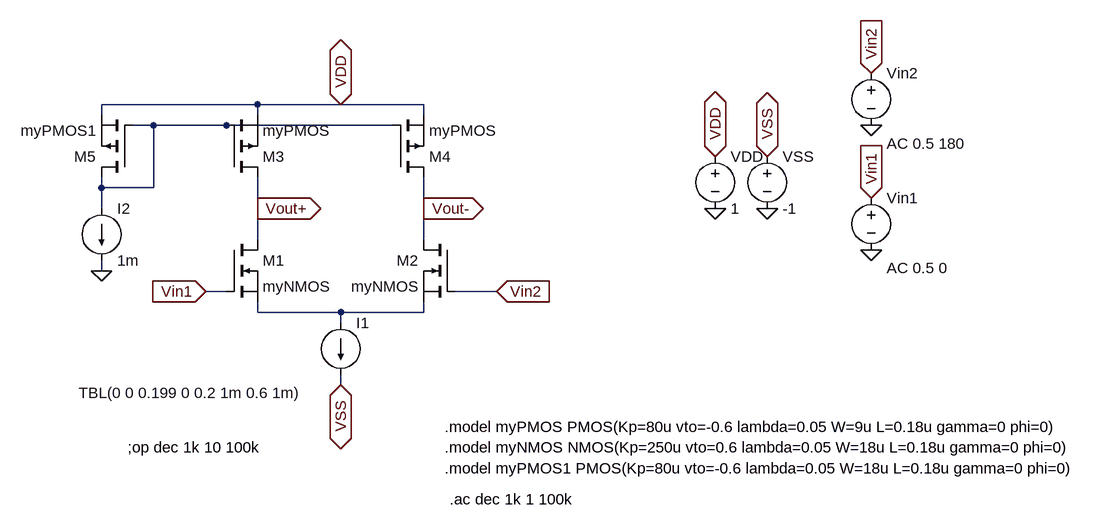
[diagram p0: schematic Project_part3.asc]
Project_part3.asc, the LTspice schematic file:
Version 4
SHEET 1 1544 680
WIRE 176 48 -64 48
WIRE 304 48 176 48
WIRE 432 48 304 48
WIRE -64 64 -64 48
WIRE 176 64 176 48
WIRE 432 64 432 48
WIRE 16 80 -16 80
WIRE 128 80 16 80
WIRE 384 80 128 80
WIRE -64 176 -64 160
WIRE 16 176 16 80
WIRE 16 176 -64 176
WIRE -64 208 -64 176
WIRE 176 208 176 160
WIRE 432 208 432 160
WIRE 176 256 176 208
WIRE 432 256 432 208
WIRE -64 304 -64 288
WIRE 128 336 96 336
WIRE 544 336 480 336
WIRE 176 368 176 352
WIRE 304 368 176 368
WIRE 432 368 432 352
WIRE 432 368 304 368
WIRE 304 384 304 368
WIRE 304 480 304 464
FLAG -64 304 0
FLAG 176 208 Vout+
IOPIN 176 208 Out
FLAG 432 208 Vout-
IOPIN 432 208 Out
FLAG 96 336 Vin1
IOPIN 96 336 In
FLAG 544 336 Vin2
IOPIN 544 336 In
FLAG 1120 272 0
FLAG 960 208 0
FLAG 880 208 0
FLAG 1120 80 0
FLAG 880 128 VDD
IOPIN 880 128 BiDir
FLAG 304 48 VDD
IOPIN 304 48 BiDir
FLAG 960 128 VSS
IOPIN 960 128 BiDir
FLAG 304 480 VSS
IOPIN 304 480 BiDir
FLAG 1120 192 Vin1
IOPIN 1120 192 In
FLAG 1120 0 Vin2
IOPIN 1120 0 In
SYMBOL pmos 384 160 M180
SYMATTR InstName M4
SYMATTR Value myPMOS
SYMBOL pmos 128 160 M180
SYMATTR InstName M3
SYMATTR Value myPMOS
SYMBOL nmos 480 256 M0
SYMATTR InstName M2
SYMATTR Value myNMOS
SYMBOL nmos 128 256 R0
SYMATTR InstName M1
SYMATTR Value myNMOS
SYMBOL current 304 384 R0
WINDOW 123 0 0 Left 0
WINDOW 39 0 0 Left 0
WINDOW 3 -403 108 Left 2
SYMATTR Value TBL(0 0 0.199 0 0.2 1m 0.6 1m)
SYMATTR InstName I1
SYMBOL pmos -16 160 R180
SYMATTR InstName M5
SYMATTR Value myPMOS1
SYMBOL current -64 208 R0
WINDOW 123 0 0 Left 0
WINDOW 39 0 0 Left 0
SYMATTR InstName I2
SYMATTR Value 1m
SYMBOL voltage 880 112 R0
WINDOW 123 0 0 Left 0
WINDOW 39 0 0 Left 0
SYMATTR InstName VDD
SYMATTR Value 1
SYMBOL voltage 960 112 R0
SYMATTR InstName VSS
SYMATTR Value -1
SYMBOL voltage 1120 -16 R0
WINDOW 123 24 124 Left 2
WINDOW 39 0 0 Left 0
SYMATTR InstName Vin2
SYMATTR Value ""
SYMATTR Value2 AC 0.5 180
SYMBOL voltage 1120 176 R0
WINDOW 123 24 124 Left 2
WINDOW 39 0 0 Left 0
SYMATTR InstName Vin1
SYMATTR Value ""
SYMATTR Value2 AC 0.5 0
TEXT 464 544 Left 2 !.model myPMOS PMOS(Kp=80u vto=-0.6 lambda=0.05 W=9u L=0.18u gamma=0 phi=0)
TEXT 464 576 Left 2 !.model myNMOS NMOS(Kp=250u vto=0.6 lambda=0.05 W=18u L=0.18u gamma=0 phi=0)
TEXT 464 608 Left 2 !.model myPMOS1 PMOS(Kp=80u vto=-0.6 lambda=0.05 W=18u L=0.18u gamma=0 phi=0)
TEXT 472 656 Left 2 !.ac dec 1k 1 100k
TEXT -24 576 Left 2 !;op dec 1k 10 100k

The netlist it stands for:
* Project_part3.asc
M4 Vout- N001 VDD VDD myPMOS
M3 Vout+ N001 VDD VDD myPMOS
M2 Vout- Vin2 N002 N002 myNMOS
M1 Vout+ Vin1 N002 N002 myNMOS
I1 N002 VSS TBL(0 0 0.199 0 0.2 1m 0.6 1m)
M5 N001 N001 VDD VDD myPMOS1
I2 N001 0 1m
VDD VDD 0 1
VSS VSS 0 -1
Vin2 Vin2 0 AC 0.5 180
Vin1 Vin1 0 AC 0.5 0
.model NMOS NMOS
.model PMOS PMOS
.lib standard.mos
.model myPMOS PMOS(Kp=80u vto=-0.6 lambda=0.05 W=9u L=0.18u gamma=0 phi=0)
.model myNMOS NMOS(Kp=250u vto=0.6 lambda=0.05 W=18u L=0.18u gamma=0 phi=0)
.model myPMOS1 PMOS(Kp=80u vto=-0.6 lambda=0.05 W=18u L=0.18u gamma=0 phi=0)
.ac dec 1k 1 100k
;op dec 1k 10 100k
.backanno
.end